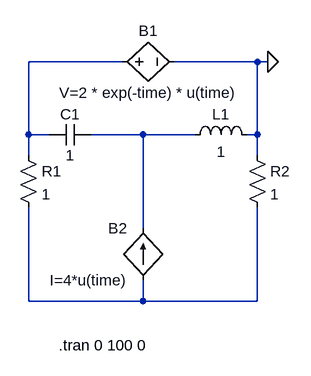
[diagram p0: schematic Draft1.asc]
Draft1.asc, the LTspice schematic file:
Version 4
SHEET 1 880 680
WIRE 192 -32 48 -32
WIRE 400 -32 272 -32
WIRE 416 -32 400 -32
WIRE 48 80 48 -32
WIRE 80 80 48 80
WIRE 224 80 144 80
WIRE 304 80 224 80
WIRE 400 80 400 -32
WIRE 400 80 384 80
WIRE 48 112 48 80
WIRE 400 112 400 80
WIRE 224 224 224 80
WIRE 48 336 48 192
WIRE 224 336 224 304
WIRE 224 336 48 336
WIRE 400 336 400 192
WIRE 400 336 224 336
FLAG 416 -32 0
SYMBOL cap 144 64 R90
WINDOW 0 0 32 VBottom 2
WINDOW 3 32 32 VTop 2
SYMATTR InstName C1
SYMATTR Value 1
SYMBOL ind 288 96 R270
WINDOW 0 32 56 VTop 2
WINDOW 3 5 56 VBottom 2
SYMATTR InstName L1
SYMATTR Value 1
SYMBOL res 32 96 R0
SYMATTR InstName R1
SYMATTR Value 1
SYMBOL res 384 96 R0
SYMATTR InstName R2
SYMATTR Value 1
SYMBOL bv 176 -32 R270
WINDOW 0 32 56 VTop 2
WINDOW 3 -32 56 VBottom 2
SYMATTR InstName B1
SYMATTR Value V=2 * exp(-time) * u(time)
SYMBOL bi 224 304 R180
WINDOW 0 24 80 Left 2
WINDOW 3 24 0 Left 2
SYMATTR InstName B2
SYMATTR Value I=4*u(time)
TEXT 94 404 Left 2 !.tran 0 100 0

The netlist it stands for:
* Draft1.asc
C1 N002 N001 1
L1 N002 0 1
R1 N001 N003 1
R2 0 N003 1
B1 N001 0 V=2 * exp(-time) * u(time)
B2 N003 N002 I=4*u(time)
.tran 0 100 0
.backanno
.end